# EAGLE schematic MicPreamp (EAGLE 9.6.2)
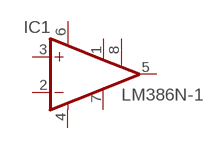
[diagram p0: schematic, sheet 1]

## Parts
IC1  LM386N-1  [DIL08]
Unconnected: IC1.1(GAIN) IC1.2(-IN) IC1.3(+IN) IC1.5(OUT) IC1.7(BYPASS) IC1.8(GAIN)

## Power pins joined to a net without a drawn wire
GND: IC1.4(GND)
VS: IC1.6(VS)

## Library data of the parts
IC1 = linear:LM386?-*: Low Voltage Audio Power Amplifier Source: http://cache.national.com/ds/LM/LM386.pdf